# Altium project ch347-v2.PrjPcb
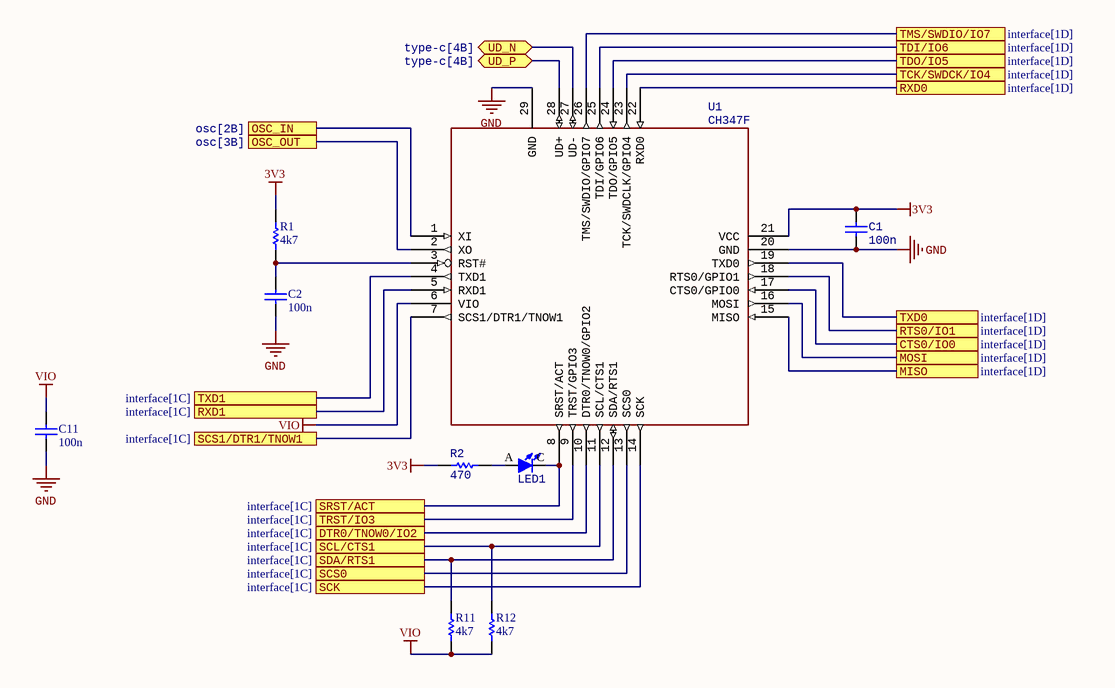
[diagram p0: ch347f.SchDoc]
5 sheets, 39 parts. Net scope: flat (ports and power ports of the same name join across sheets).
Board file: ch347-hs-usb-bridge.PcbDoc
Sheets:
  ch347f.SchDoc
  m3406.SchDoc
  type-c.SchDoc
  osc.SchDoc
  interface.SchDoc

## Sheet ch347f.SchDoc
size A4; SheetNumber: 1; SheetTotal: 5

### Parts
C1  value 100n  [CAPC100X50X55L25N]  (hidden comment: Capacitor)
C2  value 100n  [CAPC100X50X55L25N]  (hidden comment: Capacitor)
C11  value 100n  [CAPC100X50X55L25N]  (hidden comment: Capacitor)
LED1  蓝灯 正贴  [LEDC100X50X45L25N]  (value not drawn)
R1  value 4k7  [RESC100X50X35L25N]  (hidden comment: Resistor)
R2  value 470  [RESC100X50X35L25N]  (hidden comment: Resistor)
R11  value 4k7  [RESC100X50X35L25N]  (hidden comment: Resistor)
R12  value 4k7  [RESC100X50X35L25N]  (hidden comment: Resistor)
U1  CH347F  [QFN-28_L4.0-W4.0-P0.40-BL-EP2.7]

### Ports
CTS0/IO0 (see interface[1D]), DTR0/TNOW0/IO2 (see interface[1C]), MISO (see interface[1D]), MOSI (see interface[1D]), OSC_IN (see osc[2B]), OSC_OUT (see osc[3B]), RTS0/IO1 (see interface[1D]), RXD0 (see interface[1D]), RXD1 (see interface[1C]), SCK (see interface[1C]), SCL/CTS1 (see interface[1C]), SCS0 (see interface[1C]), SCS1/DTR1/TNOW1 (see interface[1C]), SDA/RTS1 (see interface[1C]), SRST/ACT (see interface[1C]), TCK/SWDCK/IO4 (see interface[1D]), TDI/IO6 (see interface[1D]), TDO/IO5 (see interface[1D]), TMS/SWDIO/IO7 (see interface[1D]), TRST/IO3 (see interface[1C]), TXD0 (see interface[1D]), TXD1 (see interface[1C]), UD_N (bidir, see type-c[4B]), UD_P (bidir, see type-c[4B])

### Nets
3V3: C1.2 R1.1 R2.1 U1.21(VCC)
GND: C1.1 C2.1 C11.1 U1.20(GND) U1.29(GND)
VIO: C11.2 R11.2 R12.2 U1.6(VIO)
CTS0/IO0: U1.17(CTS0/GPIO0) ; port CTS0/IO0
DTR0/TNOW0/IO2: U1.10(DTR0/TNOW0/GPIO2) ; port DTR0/TNOW0/IO2
MISO: U1.15(MISO) ; port MISO
MOSI: U1.16(MOSI) ; port MOSI
RTS0/IO1: U1.18(RTS0/GPIO1) ; port RTS0/IO1
RXD0: U1.22(RXD0) ; port RXD0
RXD1: U1.5(RXD1) ; port RXD1
SCK: U1.14(SCK) ; port SCK
SCL/CTS1: R12.1 U1.11(SCL/CTS1) ; port SCL/CTS1
SCS0: U1.13(SCS0) ; port SCS0
SCS1/DTR1/TNOW1: U1.7(SCS1/DTR1/TNOW1) ; port SCS1/DTR1/TNOW1
SDA/RTS1: R11.1 U1.12(SDA/RTS1) ; port SDA/RTS1
SRST/ACT: LED1.C(K) U1.8(SRST/ACT) ; port SRST/ACT
TCK/SWDCK/IO4: U1.23(TCK/SWDCLK/GPIO4) ; port TCK/SWDCK/IO4
TDI/IO6: U1.25(TDI/GPIO6) ; port TDI/IO6
TDO/IO5: U1.24(TDO/GPIO5) ; port TDO/IO5
TMS/SWDIO/IO7: U1.26(TMS/SWDIO/GPIO7) ; port TMS/SWDIO/IO7
TRST/IO3: U1.9(TRST/GPIO3) ; port TRST/IO3
TXD0: U1.19(TXD0) ; port TXD0
TXD1: U1.4(TXD1) ; port TXD1
UD_N: U1.27(UD-) ; port UD_N
UD_P: U1.28(UD+) ; port UD_P
NetC2_2: C2.2 R1.2 U1.3(RST#)
NetC7_1: U1.2(XO) ; port OSC_OUT
NetC8_2: U1.1(XI) ; port OSC_IN
NetLED1_A: LED1.A R2.2

### Library data of the parts
C1 C2 C11 = GRM188R61E106KA73D: MPN: TCC0402X5R104M250AT; Manufacturer: CCTC(三环); 编号: C359190; Case/Package: 0402; Mounting Type: SMD
LED1 = LED-SMD: 贴片LED; 编号: C965795
R1 R11 R12 = RC0402FR-07100KL: MPN: RTT02472JTH; Manufacturer: RALEC(旺诠); 编号: C103059; Case/Package: 0402; Mounting Type: SMD
R2 = RC0402FR-07100KL: MPN: RTT02471JTH; Manufacturer: RALEC(旺诠); 编号: C103058; Case/Package: 0402; Mounting Type: SMD
U1 = CH347F: High Speed USB to UART + SPI + IIC + JTAG

## Sheet m3406.SchDoc
size A4; SheetNumber: 2; SheetTotal: 5; SPICEModelCacheBYMWFIOC: <root> / <DocumentId>BYMWFIOC</DocumentId> / <CacheFrame Number="0"> / <Model Name="fuse" Kind="CKT"> / <Text>.SUBCKT FUSE 1 2 PARAMS: CURRENT=1 RESISTANCE=1m / SW1 1 2 3 0 SMOD OFF / BNLV 3 0 V=(abs(v(1,2))) / .MODEL SMOD SW (VT={(CURRENT*RESISTANCE)} RON=1g ROFF={RESISTANCE}) / .ENDS FUSE</Text> / </Model> / </CacheFrame> / </root>
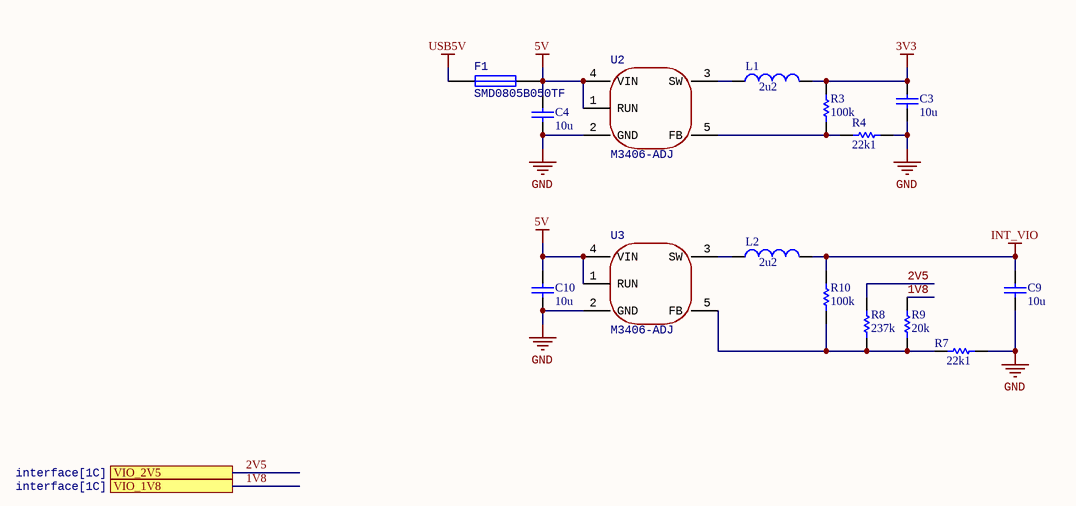
[diagram p1: m3406.SchDoc]

### Parts
C3  value 10u  [CAPC160X80X90L30N]  (hidden comment: Capacitor)
C4  value 10u  [CAPC160X80X90L30N]  (hidden comment: Capacitor)
C9  value 10u  [CAPC160X80X90L30N]  (hidden comment: Capacitor)
C10  value 10u  [CAPC160X80X90L30N]  (hidden comment: Capacitor)
F1  SMD0805B050TF  [FUSC210X135X125L37N]
L1  value 2u2  [INDC200X160X105L60N]  (hidden comment: Inductor)
L2  value 2u2  [INDC200X160X105L60N]  (hidden comment: Inductor)
R3  value 100k  [RESC100X50X35L25N]  (hidden comment: Resistor)
R4  value 22k1  [RESC100X50X35L25N]  (hidden comment: Resistor)
R7  value 22k1  [RESC100X50X35L25N]  (hidden comment: Resistor)
R8  value 237k  [RESC100X50X35L25N]  (hidden comment: Resistor)
R9  value 20k  [RESC100X50X35L25N]  (hidden comment: 80.6k)
R10  value 100k  [RESC100X50X35L25N]  (hidden comment: Resistor)
U2  M3406-ADJ  [SOT23-5P95_280X110L37X40N]
U3  M3406-ADJ  [SOT23-5P95_280X110L37X40N]

### Ports
VIO_1V8 (see interface[1C]), VIO_2V5 (see interface[1C])

### Nets
3V3: C3.2 L1.2 R3.2
5V: C4.2 C10.2 F1.2 U2.1(RUN) U2.4(VIN) U3.1(RUN) U3.4(VIN)
GND: C3.1 C4.1 C9.1 C10.1 R4.1 R7.1 U2.2(GND) U3.2(GND)
INT_VIO: C9.2 L2.2 R10.2
USB5V: F1.1
1V8: R9.2 ; port VIO_1V8
2V5: R8.2 ; port VIO_2V5
NetL1_1: L1.1 U2.3(SW)
NetL2_1: L2.1 U3.3(SW)
NetR3_1: R3.1 R4.2 U2.5(FB)
NetR7_2: R7.2 R8.1 R9.1 R10.1 U3.5(FB)

### Library data of the parts
C3 C4 C9 C10 = GRM188R61E106KA73D: MPN: TCC0603X5R106K100CT; Manufacturer: CCTC(三环); 编号: C380314; Case/Package: 0603; Mounting Type: SMD
F1 = Fuse 1: Fuse; 编号: C269104
L1 L2 = WPN201610U2R2MTY01: MPN: SFE201610-2R2M; Manufacturer: DDY(德立); 编号: C5159659; Case/Package: 201610; Mounting Type: SMD
R3 R10 = RC0402FR-07100KL: MPN: RTT021003FTH; Manufacturer: RALEC(旺诠); 编号: C102750; Case/Package: 0402; Mounting Type: SMD
R4 R7 = RC0402FR-0722K1L: MPN: RTT022212FTH; Manufacturer: RALEC(旺诠); 编号: C102896; Case/Package: 0402; Mounting Type: SMD
R8 = RC0402FR-07100KL: MPN: 0402WGF2373TCE; Manufacturer: UNI-ROYAL(厚声); 编号: C27001; Case/Package: 0402; Mounting Type: SMD
R9 = RC0402FR-07100KL: MPN: RC-02W8062FT; Manufacturer: FH(风华); 编号: C304637; Case/Package: 0402; Mounting Type: SMD
U2 U3 = M3406-ADJ: Vin=2V~6V,800mA,DCDC; Manufacturer: 西安航天民芯; 编号: C83224; MPN: M3406-ADJ; Mounting Type: SMD

## Sheet type-c.SchDoc
size A4; SheetNumber: 3; SheetTotal: 5
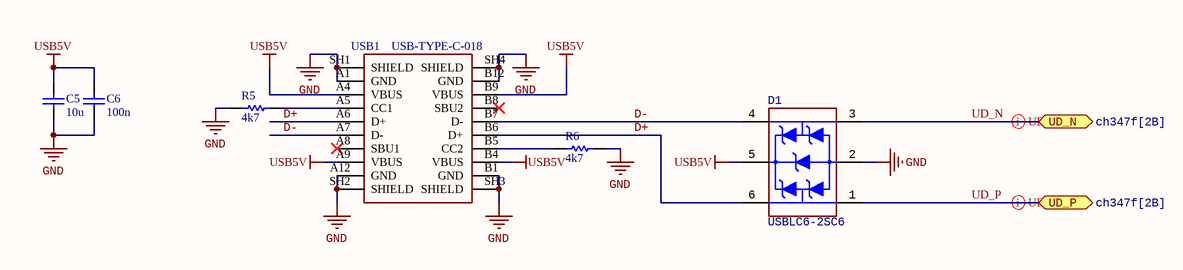
[diagram p2: type-c.SchDoc]

### Parts
C5  value 10u  [CAPC160X80X90L30N]  (hidden comment: Capacitor)
C6  value 100n  [CAPC100X50X55L25N]  (hidden comment: Capacitor)
D1  USBLC6-2SC6  [fp-0018]
R5  value 4k7  [RESC100X50X35L25N]  (hidden comment: Resistor)
R6  value 4k7  [RESC100X50X35L25N]  (hidden comment: Resistor)
USB1  USB-TYPE-C-018  [USB-TYPE-C-018]

### Ports
UD_N (bidir, see ch347f[2B]), UD_P (bidir, see ch347f[2B])

### Nets
GND: C5.1 C6.1 D1.2 R5.2 R6.1 USB1.A1(GND) USB1.A12(GND) USB1.B1(GND) USB1.B12(GND) USB1.SH1(SHIELD) USB1.SH2(SHIELD) USB1.SH3(SHIELD) USB1.SH4(SHIELD)
USB5V: C5.2 C6.2 D1.5 USB1.A4(VBUS) USB1.A9(VBUS) USB1.B4(VBUS) USB1.B9(VBUS)
D+: D1.6 USB1.A6(D+) USB1.B6(D+)
D-: D1.4 USB1.A7(D-) USB1.B7(D-)
UD_N: D1.3 ; port UD_N
UD_P: D1.1 ; port UD_P
NetR5_1: R5.1 USB1.A5(CC1)
NetR6_2: R6.2 USB1.B5(CC2)

Not connected (* = marked no-connect by the designer): USB1 A8(SBU1)* B8(SBU2)*

### Layout directives
differential pair: UD_N, UD_P

### Library data of the parts
C5 = GRM188R61E106KA73D: as C3 on sheet m3406; Case/Package: 0603; Mounting Type: SMD
C6 = GRM188R61E106KA73D: as C1 on sheet ch347f; Case/Package: 0402; Mounting Type: SMD
D1 = CMP-0000065: 15V 6V SOT-23-6 Electrostatic and Surge Protection (TVS/ESD) ROHS; Manufacturer: UMW; CPN: 000000; ID: CMP-0000065; MPN: USBLC6-2SC6; Category: TVS/ESD; ComponentLink1Description: Product Link; ComponentLink1URL: https://www.lcsc.com/product-detail/Electrostatic-and-Surge-Protection-TVS-ESD_UMW-Youtai-Semiconductor-Co-Ltd-USBLC6-2SC6_C2687116.html; ComponentLink2Description: Datasheet Link; ComponentLink2URL: https://datasheet.lcsc.com/lcsc/2311091738_UMW-Youtai-Semiconductor-Co---Ltd--USBLC6-2SC6_C2687116.pdf; LCSC PN: C2687116
R5 R6 = RC0402FR-07100KL: as R1 on sheet ch347f; Case/Package: 0402; Mounting Type: SMD
USB1 = USB-TYPE-C-018: 编号: C2927038

## Sheet osc.SchDoc
size A4; SheetNumber: 4; SheetTotal: 5
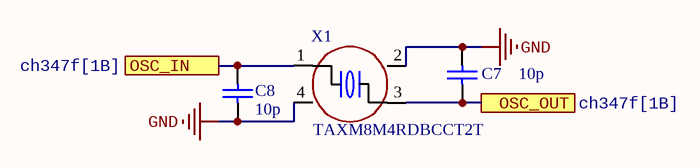
[diagram p3: osc.SchDoc]

### Parts
C7  value 10p  [CAPC100X50X55L25N]  (hidden comment: Capacitor)
C8  value 10p  [CAPC100X50X55L25N]  (hidden comment: Capacitor)
X1  TAXM8M4RDBCCT2T  [OSCCC320X250X80L90X100N]

### Ports
OSC_IN (see ch347f[1B]), OSC_OUT (see ch347f[1B])

### Nets
GND: C7.2 C8.1 X1.2(GND) X1.4(GND)
NetC7_1: C7.1 X1.3 ; port OSC_OUT
NetC8_2: C8.2 X1.1 ; port OSC_IN

### Library data of the parts
C7 C8 = GRM188R61E106KA73D: MPN: CC0402JRNPO9BN100; Manufacturer: YAGEO(国巨); 编号: C106199; Case/Package: 0402; Mounting Type: SMD
X1 = X32258MSB4SI: 8MHz ±10ppm 10pF; Manufacturer: TAE(雅晶鑫); 编号: C400090

## Sheet interface.SchDoc
size A4; SheetNumber: 5; SheetTotal: 5
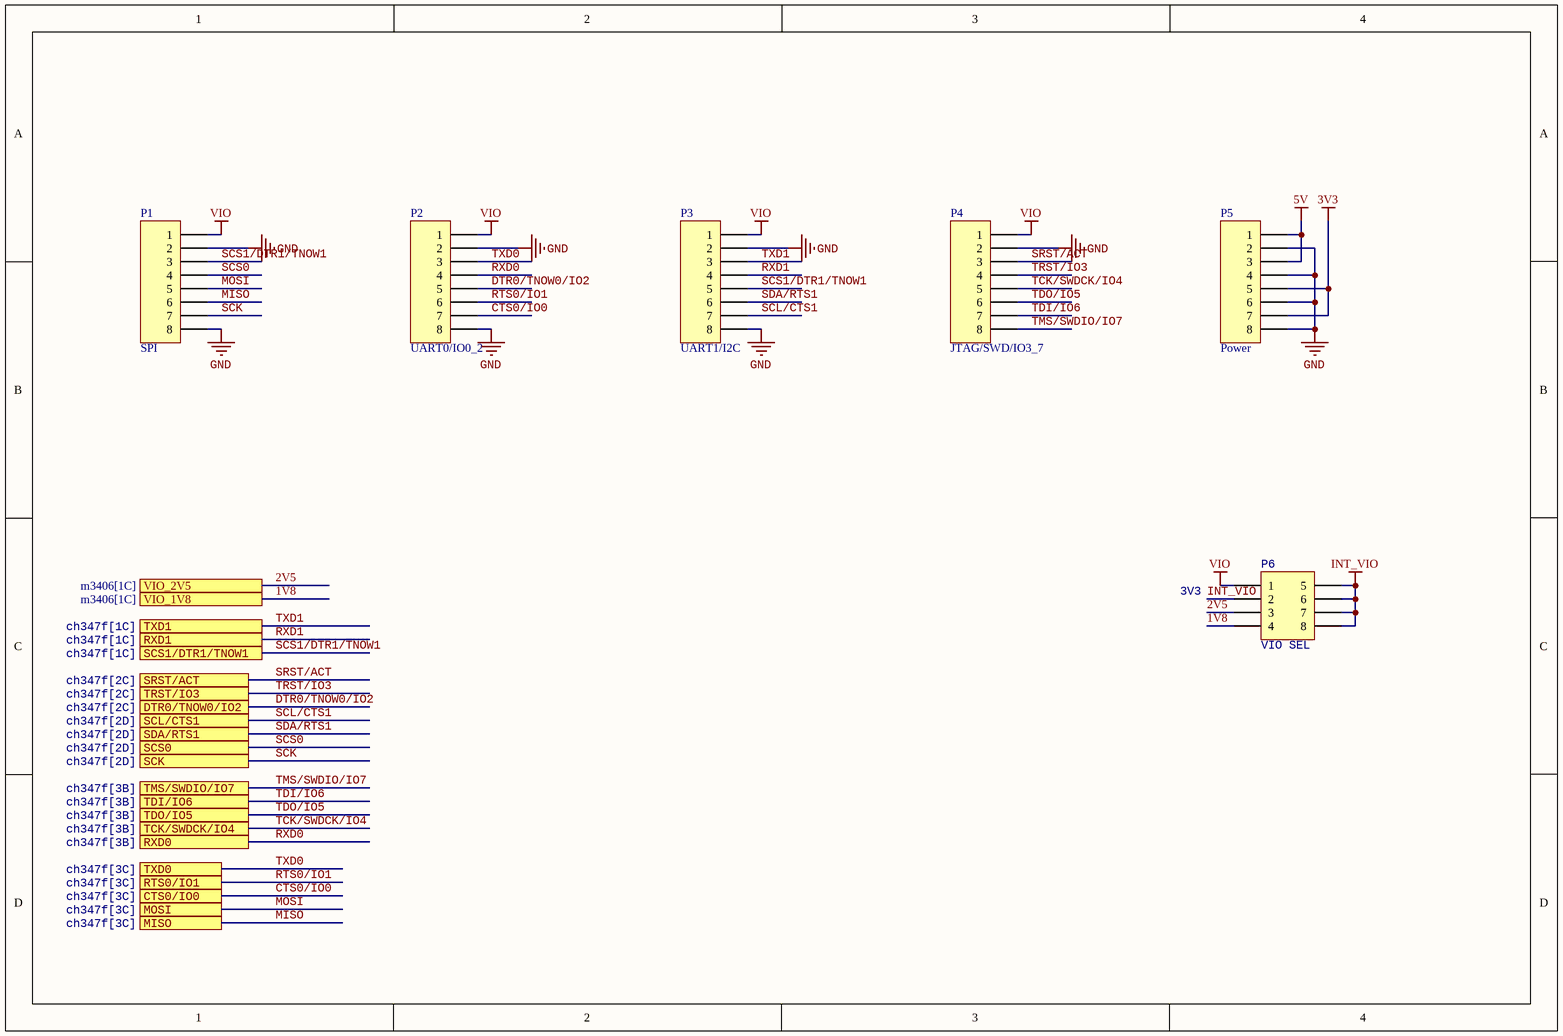
[diagram p4: interface.SchDoc]

### Parts
P1  SPI  [CONN-SMD_PH2.0-8P-LT]
P2  UART0/IO0_2  [CONN-SMD_PH2.0-8P-LT]
P3  UART1/I2C  [CONN-SMD_PH2.0-8P-LT]
P4  JTAG/SWD/IO3_7  [CONN-SMD_PH2.0-8P-LT]
P5  Power  [CONN-SMD_PH2.0-8P-LT]
P6  VIO SEL  [CONN-SMD_HX-PZ2.0-2X4P-TP]

### Ports
CTS0/IO0 (see ch347f[3C]), DTR0/TNOW0/IO2 (see ch347f[2C]), MISO (see ch347f[3C]), MOSI (see ch347f[3C]), RTS0/IO1 (see ch347f[3C]), RXD0 (see ch347f[3B]), RXD1 (see ch347f[1C]), SCK (see ch347f[2D]), SCL/CTS1 (see ch347f[2D]), SCS0 (see ch347f[2D]), SCS1/DTR1/TNOW1 (see ch347f[1C]), SDA/RTS1 (see ch347f[2D]), SRST/ACT (see ch347f[2C]), TCK/SWDCK/IO4 (see ch347f[3B]), TDI/IO6 (see ch347f[3B]), TDO/IO5 (see ch347f[3B]), TMS/SWDIO/IO7 (see ch347f[3B]), TRST/IO3 (see ch347f[2C]), TXD0 (see ch347f[3C]), TXD1 (see ch347f[1C]), VIO_1V8 (see m3406[1C]), VIO_2V5 (see m3406[1C])

### Nets
3V3: P5.5 P5.7
5V: P5.1 P5.3
GND: P1.2 P1.8 P2.2 P2.8 P3.2 P3.8 P4.2 P5.2 P5.4 P5.6 P5.8
INT_VIO: P6.2 P6.5 P6.6 P6.7 P6.8
VIO: P1.1 P2.1 P3.1 P4.1 P6.1
1V8: P6.4 ; port VIO_1V8
2V5: P6.3 ; port VIO_2V5
CTS0/IO0: P2.7 ; port CTS0/IO0
DTR0/TNOW0/IO2: P2.5 ; port DTR0/TNOW0/IO2
MISO: P1.6 ; port MISO
MOSI: P1.5 ; port MOSI
RTS0/IO1: P2.6 ; port RTS0/IO1
RXD0: P2.4 ; port RXD0
RXD1: P3.4 ; port RXD1
SCK: P1.7 ; port SCK
SCL/CTS1: P3.7 ; port SCL/CTS1
SCS0: P1.4 ; port SCS0
SCS1/DTR1/TNOW1: P1.3 P3.5 ; port SCS1/DTR1/TNOW1
SDA/RTS1: P3.6 ; port SDA/RTS1
SRST/ACT: P4.3 ; port SRST/ACT
TCK/SWDCK/IO4: P4.5 ; port TCK/SWDCK/IO4
TDI/IO6: P4.7 ; port TDI/IO6
TDO/IO5: P4.6 ; port TDO/IO5
TMS/SWDIO/IO7: P4.8 ; port TMS/SWDIO/IO7
TRST/IO3: P4.4 ; port TRST/IO3
TXD0: P2.3 ; port TXD0
TXD1: P3.3 ; port TXD1

### Notes on the sheet
- 3V3

### Library data of the parts
P1-P5 = Header 8: Header, 8-Pin; LatestRevisionDate: 17-Jul-2002; LatestRevisionNote: Re-released for DXP Platform.; Publisher: Altium Limited
P6 = Header 4X2A: Header, 4-Pin, Dual row; LatestRevisionDate: 17-Jul-2002; LatestRevisionNote: Re-released for DXP Platform.; Publisher: Altium Limited

## Nets that join several sheets
3V3: ch347f (C1.2 R1.1 R2.1 U1.21), m3406 (C3.2 L1.2 R3.2), interface (P5.5 P5.7)
5V: m3406 (7 pins), interface (P5.1 P5.3)
GND: ch347f (5 pins), m3406 (8 pins), type-c (13 pins), osc (C7.2 C8.1 X1.2 X1.4), interface (11 pins)
INT_VIO: m3406 (C9.2 L2.2 R10.2), interface (5 pins)
USB5V: m3406 (F1.1), type-c (7 pins)
VIO: ch347f (C11.2 R11.2 R12.2 U1.6), interface (5 pins)
1V8: m3406 (R9.2), interface (P6.4)
2V5: m3406 (R8.2), interface (P6.3)
CTS0/IO0: ch347f (U1.17), interface (P2.7)
DTR0/TNOW0/IO2: ch347f (U1.10), interface (P2.5)
MISO: ch347f (U1.15), interface (P1.6)
MOSI: ch347f (U1.16), interface (P1.5)
NetC7_1: ch347f (U1.2), osc (C7.1 X1.3)
NetC8_2: ch347f (U1.1), osc (C8.2 X1.1)
RTS0/IO1: ch347f (U1.18), interface (P2.6)
RXD0: ch347f (U1.22), interface (P2.4)
RXD1: ch347f (U1.5), interface (P3.4)
SCK: ch347f (U1.14), interface (P1.7)
SCL/CTS1: ch347f (R12.1 U1.11), interface (P3.7)
SCS0: ch347f (U1.13), interface (P1.4)
SCS1/DTR1/TNOW1: ch347f (U1.7), interface (P1.3 P3.5)
SDA/RTS1: ch347f (R11.1 U1.12), interface (P3.6)
SRST/ACT: ch347f (LED1.C U1.8), interface (P4.3)
TCK/SWDCK/IO4: ch347f (U1.23), interface (P4.5)
TDI/IO6: ch347f (U1.25), interface (P4.7)
TDO/IO5: ch347f (U1.24), interface (P4.6)
TMS/SWDIO/IO7: ch347f (U1.26), interface (P4.8)
TRST/IO3: ch347f (U1.9), interface (P4.4)
TXD0: ch347f (U1.19), interface (P2.3)
TXD1: ch347f (U1.4), interface (P3.3)
UD_N: ch347f (U1.27), type-c (D1.3)
UD_P: ch347f (U1.28), type-c (D1.1)